# EAGLE design rapidshark-clip-detector-mk-1.2 (EAGLE 6.5.0)
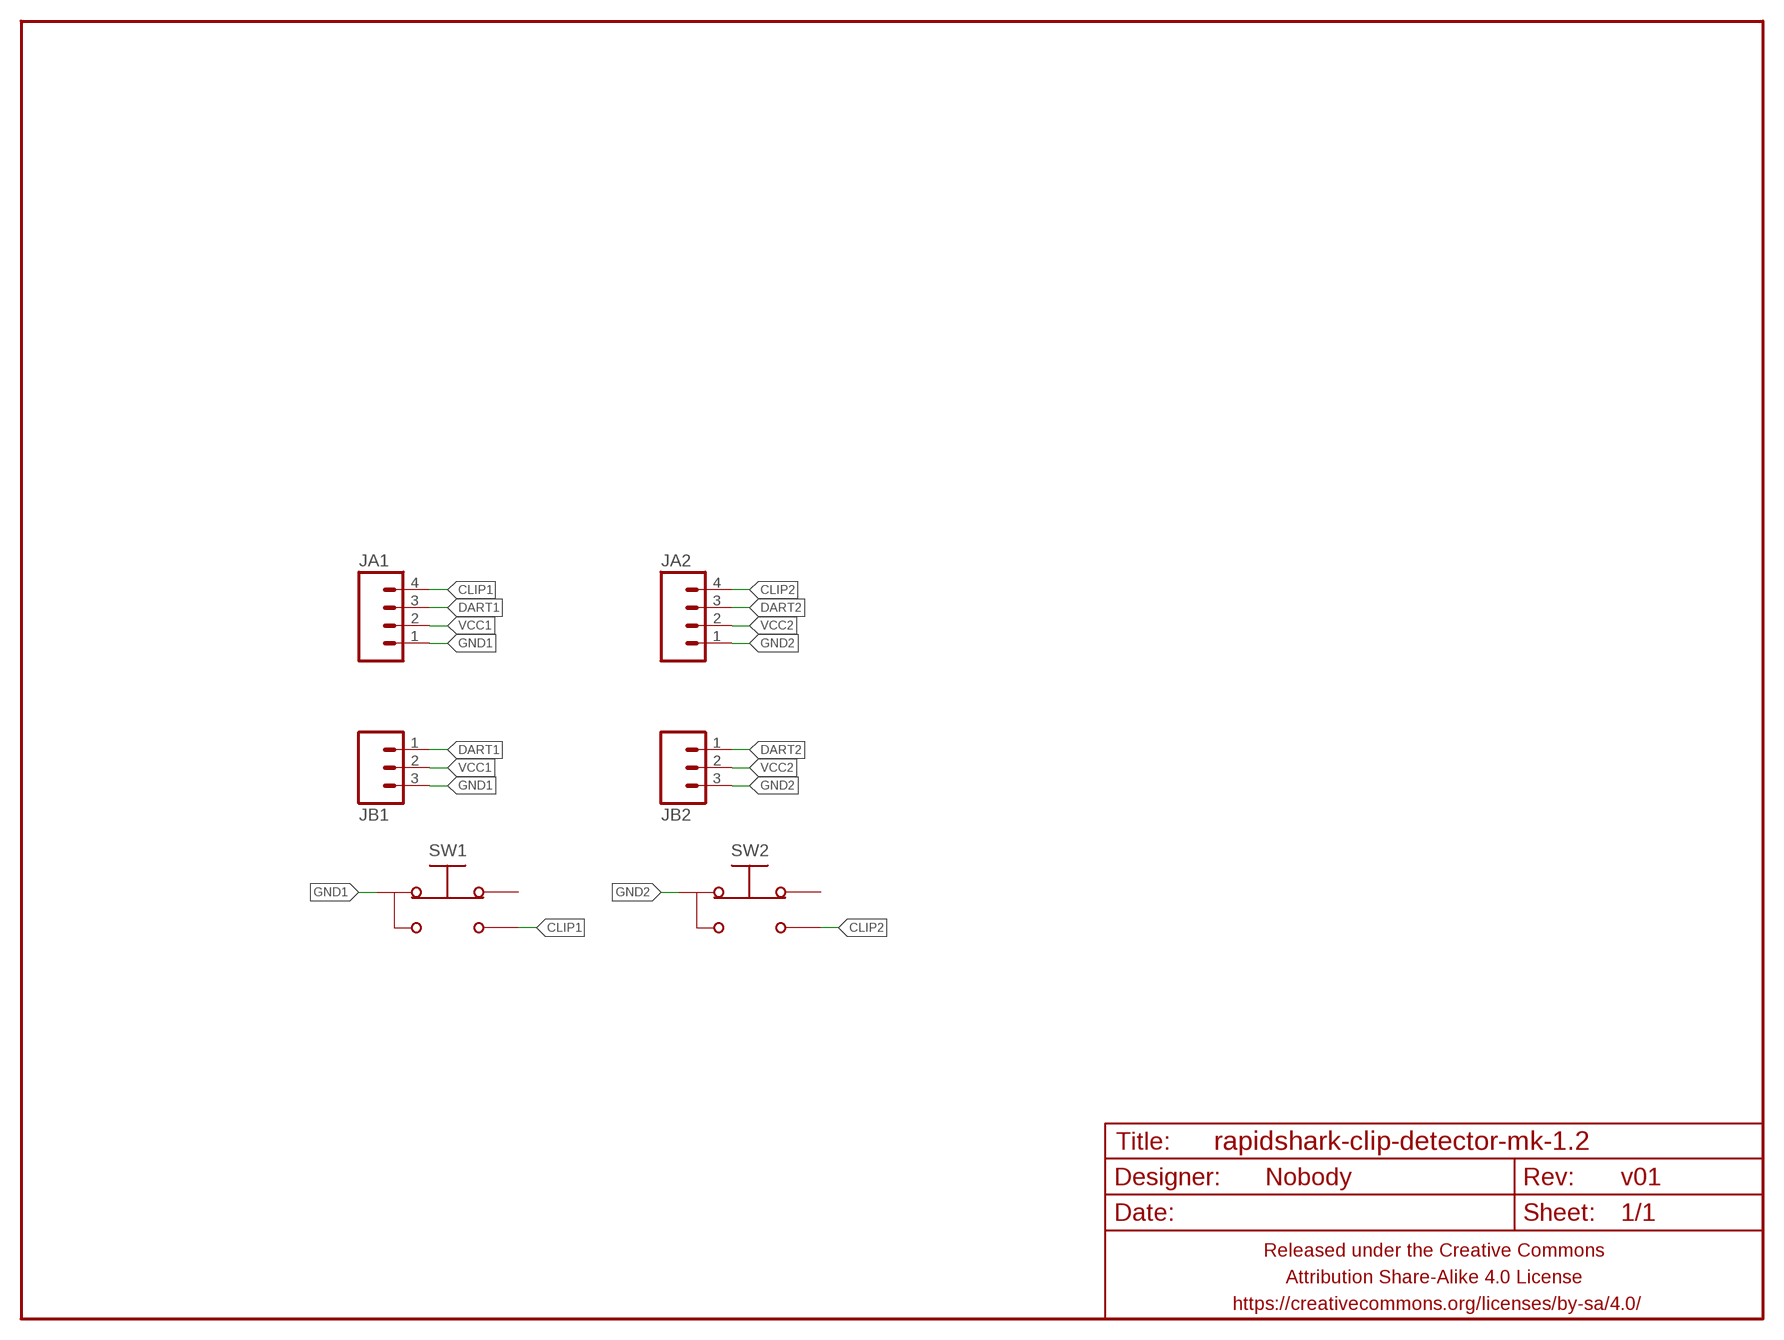
[diagram p0: schematic, sheet 1]

## Parts
FRAME1  FRAME-LETTERNO_PACKAGE  [DUMMY]
JA1  M04JST-PTH-VERT  [JST-4-PH-VERT-PTH]
JA2  M04JST-PTH-VERT  [JST-4-PH-VERT-PTH]
JB1  M03JST-PTH-VERT  [JST-3-PH-VERT-PTH]
JB2  M03JST-PTH-VERT  [JST-3-PH-VERT-PTH]
SW1  SPDT-NO-TACTPTH-RA-DETECT-3MM  [SWITCH-DETECH-SPDT-3MM]
SW2  SPDT-NO-TACTPTH-RA-DETECT-3MM  [SWITCH-DETECH-SPDT-3MM]

## Nets
CLIP1: JA1.4 SW1.3(NO)
CLIP2: JA2.4 SW2.3(NO)
DART1: JA1.3 JB1.1
DART2: JA2.3 JB2.1
GND1: JA1.1 JB1.3 SW1.2(COM)
GND2: JA2.1 JB2.3 SW2.2(COM)
VCC1: JA1.2 JB1.2
VCC2: JA2.2 JB2.2
Unconnected: SW1.1(NC) SW2.1(NC)

## Library data of the parts
FRAME1 = A_butts:FRAME-LETTER: Schematic Frame Standard 8.5x11 US Letter frame; DESIGNER: Nobody; VERSION: v01
JA1 JA2 = A_butts:M04: Header 4 Standard 4-pin 0.1" header. Use with straight break away headers (SKU : PRT-00116), right angle break away headers (PRT-00553), swiss pins (PRT-00743), machine pins (PRT-00117), and female headers (PRT-00115). Molex polarized connector foot print use with SKU : PRT-08231 with associated crimp pins and housings. 1MM SMD Version SKU: PRT-10208
JB1 JB2 = A_butts:M03: Header 3 Standard 3-pin 0.1" header. Use with straight break away headers (SKU : PRT-00116), right angle break away headers (PRT-00553), swiss pins (PRT-00743), machine pins (PRT-00117), and female headers (PRT-00115). Molex polarized connector foot print use with SKU : PRT-08232 with associated crimp pins and housings.
SW1 SW2 = A_butts:SPDT-NO-TACT

## Board
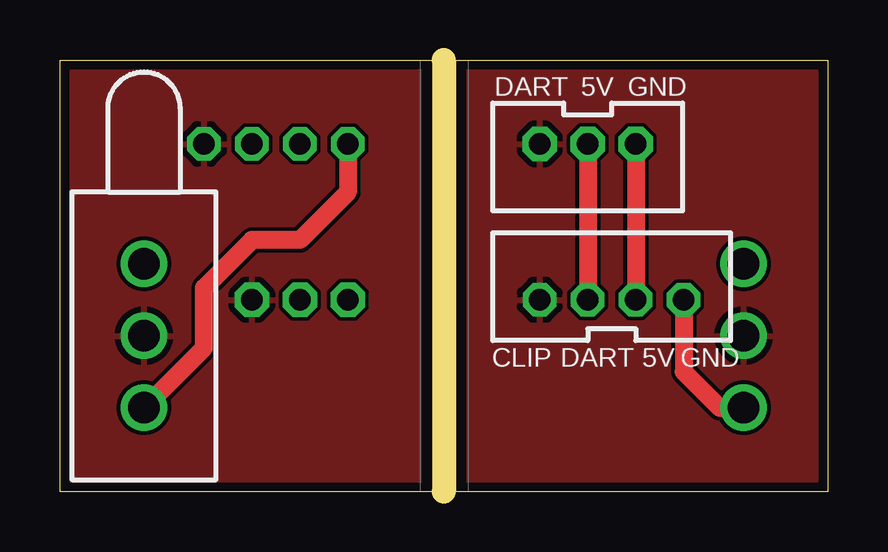
[diagram p1: board, top side]
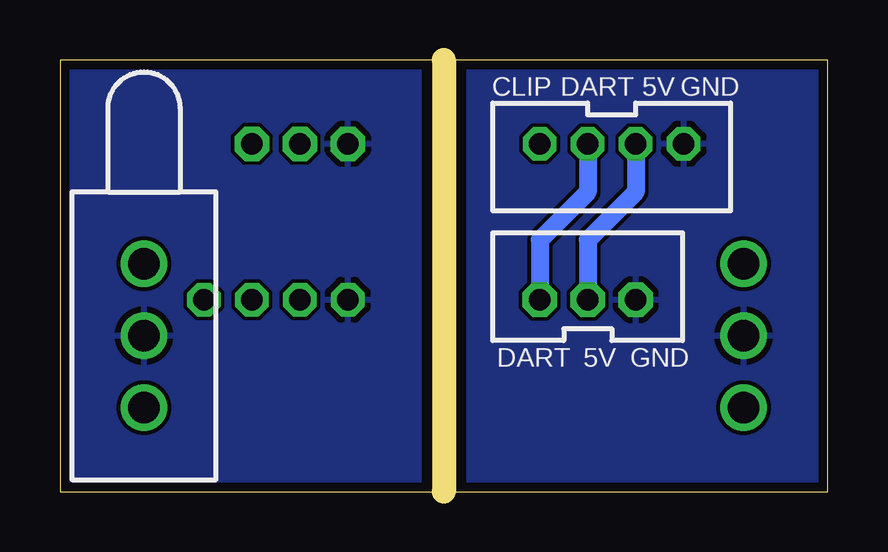
[diagram p2: board, bottom side, seen from below]

Size 32 x 18 mm. Coordinates in mm from the lower left corner, seen from the top.
Outline: 0,18 32,18 32,0 0,0 0,18
Copper layers (1*16): Top 0.0356mm / dielectric 1.5011mm / Bottom 0.0356mm
Design rules "LaenPCBOrder_2": minimum track width 6mil, minimum drill 13mil, track to track 6mil, track to pad 6mil, pad to pad 6mil, via to via 6mil, smd to smd 6mil, copper to edge 15mil, drill to drill 6mil, minimum pad ring 7mil, minimum via ring 7mil, stop-mask expansion 3mil, vias tented up to drill 20mil, thermal gap 10mil
Milling: 1 lines

### Footprints (pad centres in the part's own frame; a part is rotated, then mirrored left to right if it is on the bottom)
JST-4-PH-VERT-PTH = drill 0.9 pad 1.4 octagon: 1 0,0; 2 2,0; 3 4,0; 4 6,0
JST-3-PH-VERT-PTH = drill 0.9 pad 1.422 octagon: 1 0,0; 2 2,0; 3 4,0
SWITCH-DETECH-SPDT-3MM = drill 1.3 pad 1.88: 1 0,3; 2 0,0; 3 0,-3

### Placement (x,y rotation side)
FRAME1  0,0 180 bottom
JA1  6,14.5 180 bottom
JA2  20,8 0 top
JB1  12,8 0 bottom
JB2  24,14.5 180 top
SW1  3.5,6.5 0 top
SW2  28.5,6.5 0 bottom

### Tracks (layer width: path | path; a pad name or v marks a point on that pad's centre or on a via)
CLIP1
  Top 0.75: JA1.4 12,12.5 10,10.5 8,10.5 6,8.5 6,6 SW1.3
CLIP2
  Top 0.75: JA2.4 26,5 27.5,3.5 SW2.3
DART1
  Bottom 0.75: JA1.3 10,12.5 12,10.5 JB1.1
DART2
  Top 0.75: JB2.1 JA2.3
GND1
  pour Top (isolate 0.152, rank 5): 0,18 0,0 15,0 15,18
  pour Bottom (isolate 0.152, rank 5): 15,18 0,18 0,0 15,0
GND2
  pour Top (isolate 0.152): 17,18 32,18 32,0 17,0
  pour Bottom (isolate 0.152): 17,18 32,18 32,0 17,0
VCC1
  Bottom 0.75: JA1.2 8,12.5 10,10.5 JB1.2
VCC2
  Top 0.75: JB2.2 JA2.2

### Text on the board
tPlace: DART | 5V | GND | CLIP | DART | 5V | GND
bPlace: GND | 5V | DART | CLIP | GND | 5V | DART